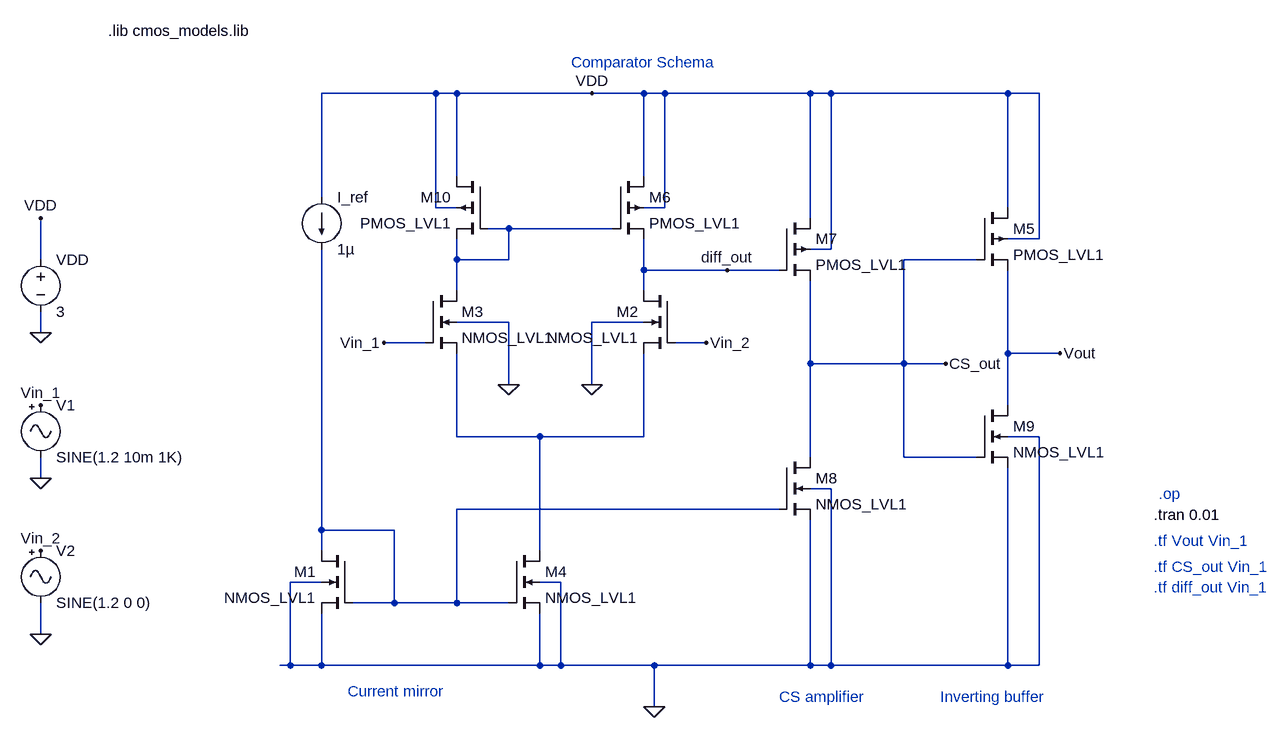
[diagram p0: schematic comparator_design.asc]
comparator_design.asc, the LTspice schematic file:
Version 4
SHEET 1 1864 680
WIRE 544 -432 368 -432
WIRE 576 -432 544 -432
WIRE 784 -432 576 -432
WIRE 864 -432 784 -432
WIRE 896 -432 864 -432
WIRE 1120 -432 896 -432
WIRE 1152 -432 1120 -432
WIRE 1424 -432 1152 -432
WIRE 1472 -432 1424 -432
WIRE 576 -304 576 -432
WIRE 864 -304 864 -432
WIRE 368 -272 368 -432
WIRE 544 -256 544 -432
WIRE 576 -256 544 -256
WIRE 896 -256 896 -432
WIRE 896 -256 864 -256
WIRE 1424 -256 1424 -432
WIRE 1120 -240 1120 -432
WIRE 656 -224 624 -224
WIRE 816 -224 656 -224
WIRE 1472 -208 1472 -432
WIRE 1472 -208 1424 -208
WIRE 1152 -192 1152 -432
WIRE 1152 -192 1120 -192
WIRE -64 -176 -64 -240
WIRE 576 -176 576 -208
WIRE 656 -176 656 -224
WIRE 656 -176 576 -176
WIRE 1376 -176 1264 -176
WIRE 864 -160 864 -208
WIRE 992 -160 864 -160
WIRE 1072 -160 992 -160
WIRE 576 -128 576 -176
WIRE 864 -128 864 -160
WIRE 656 -80 576 -80
WIRE 864 -80 784 -80
WIRE -64 -64 -64 -96
WIRE 528 -48 464 -48
WIRE 960 -48 912 -48
WIRE 1424 -32 1424 -160
WIRE 1504 -32 1424 -32
WIRE 1120 -16 1120 -144
WIRE 1264 -16 1264 -176
WIRE 1264 -16 1120 -16
WIRE 1328 -16 1264 -16
WIRE 656 16 656 -80
WIRE 784 16 784 -80
WIRE 1424 48 1424 -32
WIRE 576 96 576 -32
WIRE 704 96 576 96
WIRE 864 96 864 -32
WIRE 864 96 704 96
WIRE 1472 96 1424 96
WIRE 1120 128 1120 -16
WIRE 1264 128 1264 -16
WIRE 1376 128 1264 128
WIRE -64 160 -64 128
WIRE 1152 176 1120 176
WIRE 1072 208 576 208
WIRE 368 240 368 -192
WIRE 480 240 368 240
WIRE 368 272 368 240
WIRE 704 272 704 96
WIRE 368 320 320 320
WIRE 736 320 704 320
WIRE 480 352 480 240
WIRE 480 352 416 352
WIRE 576 352 576 208
WIRE 576 352 480 352
WIRE 656 352 576 352
WIRE -64 400 -64 352
WIRE 320 448 320 320
WIRE 320 448 304 448
WIRE 368 448 368 368
WIRE 368 448 320 448
WIRE 704 448 704 368
WIRE 704 448 368 448
WIRE 736 448 736 320
WIRE 736 448 704 448
WIRE 880 448 736 448
WIRE 1120 448 1120 224
WIRE 1120 448 880 448
WIRE 1152 448 1152 176
WIRE 1152 448 1120 448
WIRE 1424 448 1424 144
WIRE 1424 448 1152 448
WIRE 1472 448 1472 96
WIRE 1472 448 1424 448
WIRE 880 512 880 448
FLAG -64 -240 VDD
FLAG -64 -64 0
FLAG 784 -432 VDD
FLAG 880 512 0
FLAG 464 -48 Vin_1
FLAG 960 -48 Vin_2
FLAG 656 16 0
FLAG 784 16 0
FLAG 1504 -32 Vout
FLAG -64 400 0
FLAG -64 160 0
FLAG -64 272 Vin_2
FLAG -64 48 Vin_1
FLAG 1328 -16 CS_out
FLAG 992 -160 diff_out
DATAFLAG 1472 -32 ""
DATAFLAG 1200 -16 ""
DATAFLAG 704 160 ""
DATAFLAG 864 -192 "$"
DATAFLAG 896 208 "$"
DATAFLAG 1328 288 "$"
SYMBOL voltage -64 -192 R0
WINDOW 123 0 0 Left 0
WINDOW 39 0 0 Left 0
SYMATTR InstName VDD
SYMATTR Value 3
SYMBOL current 368 -272 R0
WINDOW 123 0 0 Left 0
WINDOW 39 0 0 Left 0
SYMATTR InstName I_ref
SYMATTR Value 1µ
SYMBOL nmos4 416 272 M0
SYMATTR InstName M1
SYMATTR Value NMOS_LVL1
SYMATTR Value2 l=5u w=5u
SYMBOL nmos4 912 -128 M0
SYMATTR InstName M2
SYMATTR Value NMOS_LVL1
SYMATTR Value2 l=5u w=45u
SYMBOL nmos4 528 -128 R0
SYMATTR InstName M3
SYMATTR Value NMOS_LVL1
SYMATTR Value2 l=5u w=45u
SYMBOL nmos4 656 272 R0
SYMATTR InstName M4
SYMATTR Value NMOS_LVL1
SYMATTR Value2 l=5u w=60u
SYMBOL pmos4 816 -304 R0
SYMATTR InstName M6
SYMATTR Value PMOS_LVL1
SYMATTR Value2 l=5u w=5u
SYMBOL nmos4 1072 128 R0
SYMATTR InstName M8
SYMATTR Value NMOS_LVL1
SYMATTR Value2 l=5u w=5u
SYMBOL nmos4 1376 48 R0
SYMATTR InstName M9
SYMATTR Value NMOS_LVL1
SYMATTR Value2 l=5u w=5u
SYMBOL pmos4 1376 -256 R0
SYMATTR InstName M5
SYMATTR Value PMOS_LVL1
SYMATTR Value2 l=5u w=5u
SYMBOL pmos4 1072 -240 R0
SYMATTR InstName M7
SYMATTR Value PMOS_LVL1
SYMATTR Value2 l=5u w=5u
SYMBOL pmos4 624 -304 M0
SYMATTR InstName M10
SYMATTR Value PMOS_LVL1
SYMATTR Value2 l=5u w=5u
SYMBOL signal -64 32 R0
WINDOW 123 0 0 Left 0
WINDOW 39 0 0 Left 0
SYMATTR InstName V1
SYMATTR Value SINE(1.2 10m 1K)
SYMBOL signal -64 256 R0
WINDOW 123 0 0 Left 0
WINDOW 39 0 0 Left 0
SYMATTR InstName V2
SYMATTR Value SINE(1.2 0 0)
TEXT 40 -528 Left 2 !.lib cmos_models.lib
TEXT 1072 496 Left 2 ;CS amplifier
TEXT 1320 496 Left 2 ;Inverting buffer
TEXT 408 488 Left 2 ;Current mirror
TEXT 1648 256 Left 2 ;.tf Vout Vin_1
TEXT 1648 296 Left 2 ;.tf CS_out Vin_1
TEXT 1648 328 Left 2 ;.tf diff_out Vin_1
TEXT 1648 216 Left 2 !.tran 0.01
TEXT 1656 184 Left 2 ;.op
TEXT 752 -480 Left 2 ;Comparator Schema

The netlist it stands for:
* comparator_design.asc
VDD VDD 0 3
I_ref VDD N003 1µ
M1 N003 N003 0 0 NMOS_LVL1 l=5u w=5u
M2 diff_out Vin_2 N002 0 NMOS_LVL1 l=5u w=45u
M3 N001 Vin_1 N002 0 NMOS_LVL1 l=5u w=45u
M4 N002 N003 0 0 NMOS_LVL1 l=5u w=60u
M6 VDD N001 diff_out VDD PMOS_LVL1 l=5u w=5u
M8 CS_out N003 0 0 NMOS_LVL1 l=5u w=5u
M9 Vout CS_out 0 0 NMOS_LVL1 l=5u w=5u
M5 VDD CS_out Vout VDD PMOS_LVL1 l=5u w=5u
M7 VDD diff_out CS_out VDD PMOS_LVL1 l=5u w=5u
M10 VDD N001 N001 VDD PMOS_LVL1 l=5u w=5u
V1 Vin_1 0 SINE(1.2 10m 1K)
V2 Vin_2 0 SINE(1.2 0 0)
.model NMOS NMOS
.model PMOS PMOS
.lib standard.mos
.lib cmos_models.lib
* CS amplifier
* Inverting buffer
* Current mirror
* .tf Vout Vin_1
* .tf CS_out Vin_1
* .tf diff_out Vin_1
.tran 0.01
* .op
* Comparator Schema
.backanno
.end